# EAGLE schematic lights (EAGLE 9.6.2)
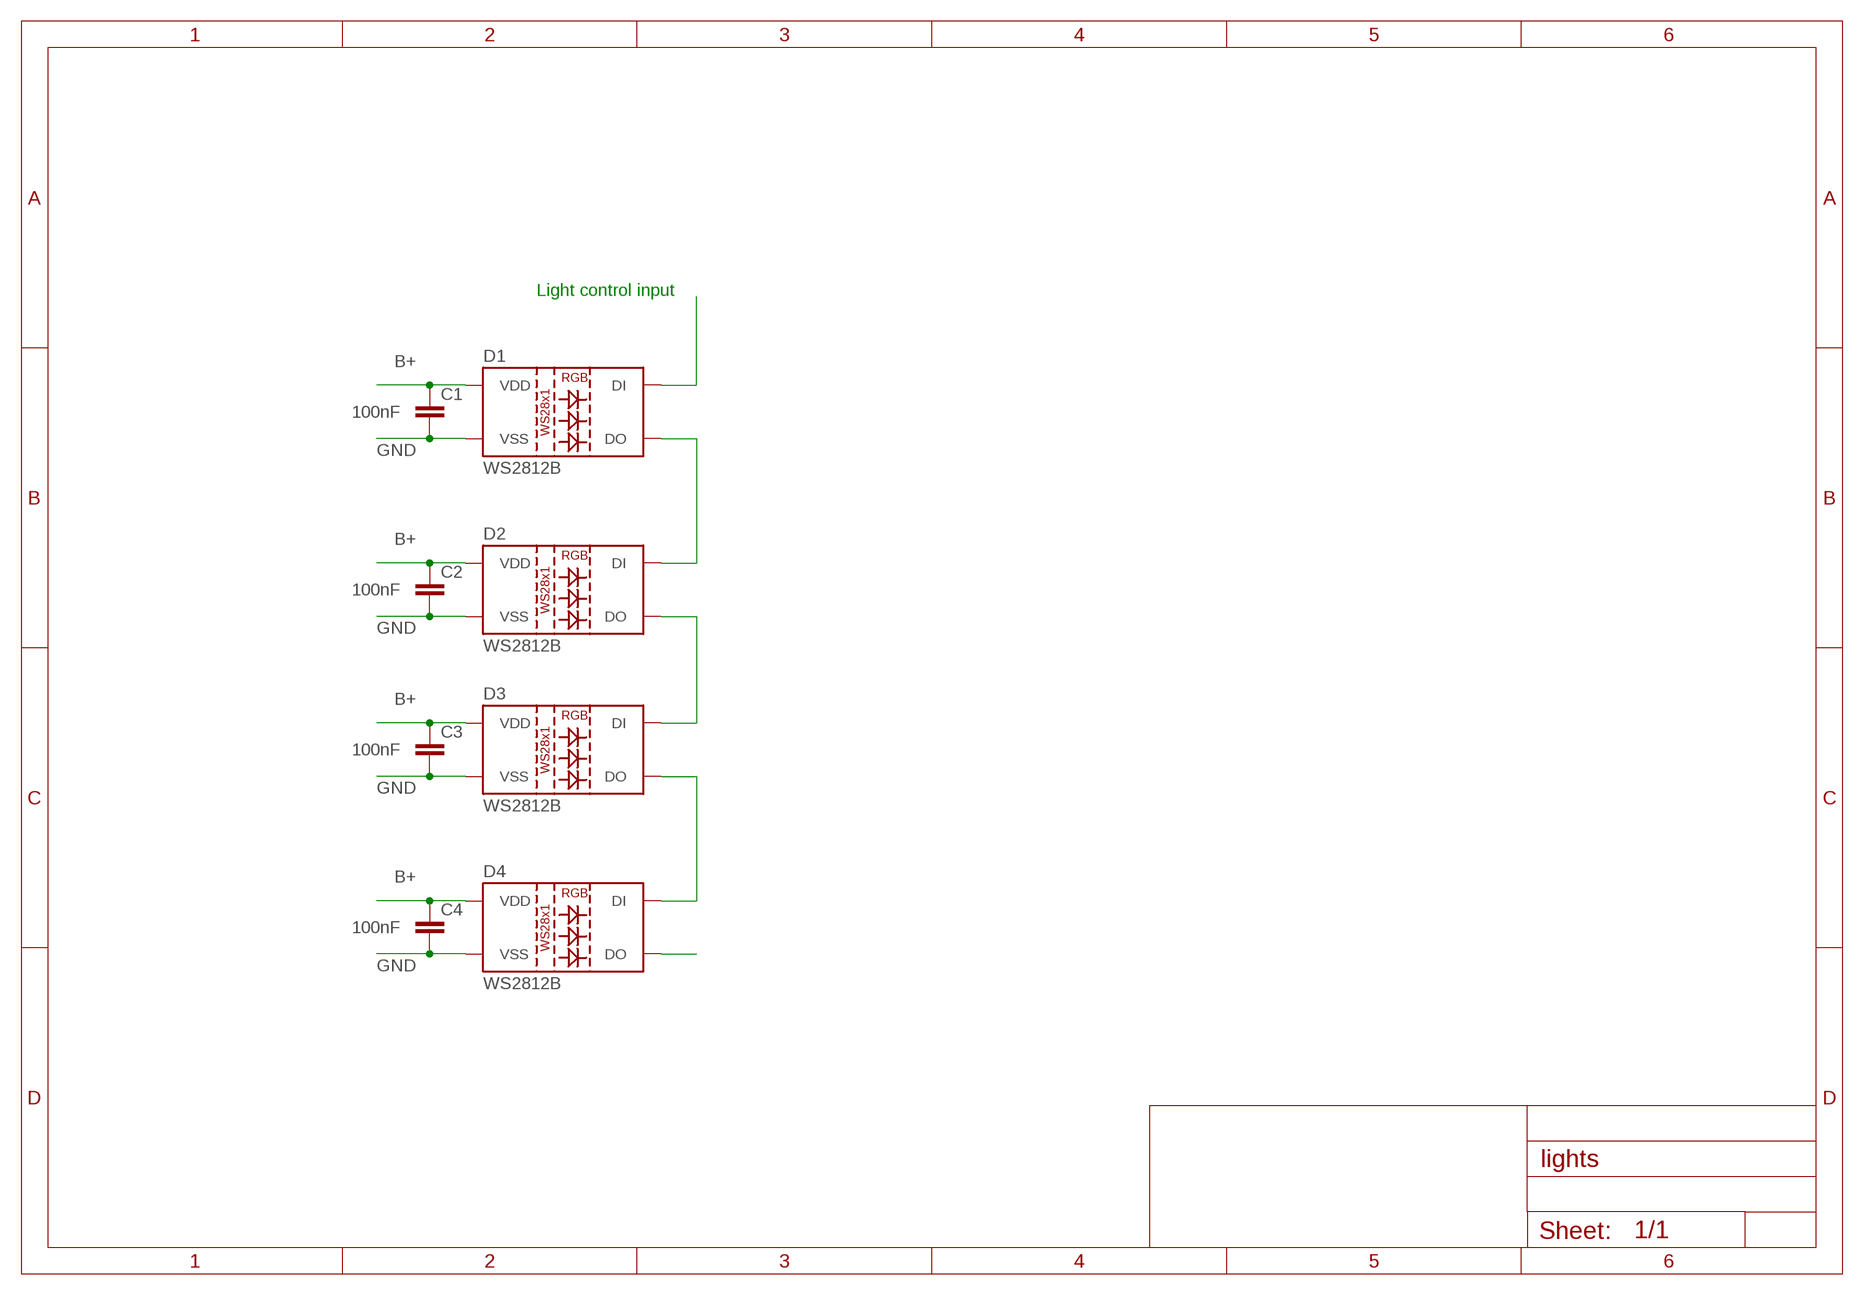
[diagram p0: schematic, sheet 1]

## Parts
C1  100nF  CAP0805  [0805]
C2  100nF  CAP0805  [0805]
C3  100nF  CAP0805  [0805]
C4  100nF  CAP0805  [0805]
D1  WS2812B  [WS2812B]
D2  WS2812B  [WS2812B]
D3  WS2812B  [WS2812B]
D4  WS2812B  [WS2812B]

## Nets
B+: C1.1 C2.1 C3.1 C4.1 D1.1(VDD) D2.1(VDD) D3.1(VDD) D4.1(VDD)
GND: C1.2 C2.2 C3.2 C4.2 D1.3(VSS) D2.3(VSS) D3.3(VSS) D4.3(VSS)
N$1: D1.4(DI)
N$2: D1.2(DO) D2.4(DI)
N$4: D2.2(DO) D3.4(DI)
N$6: D3.2(DO) D4.4(DI)
N$8: D4.2(DO)

## Notes on the sheet
- Light control input

## Library data of the parts
C1-C4 = SparkFun-Passives:CAP: Capacitor Standard 0603 ceramic capacitor, and 0.1" leaded capacitor.
D1-D4 = SparkFun-LED:WS2812B: WS2812B SMD addressable RGB LED 5x5mm SMD LED with built-in controller IC. Color: Red/Green/Blue mC Rating: RGB: 390, 660, 180 mcd Forward Voltage: RGB: 2.0, 3.0, 3.0 V Packages:WS2812B SparkFun Products: Blynk Board - ESP8266 <https://www.sparkfun.com/products/13794>; PROD_ID: DIO-12503